# Altium schematic sheet Wand Controllers.schdoc
size 323 x 219 mm
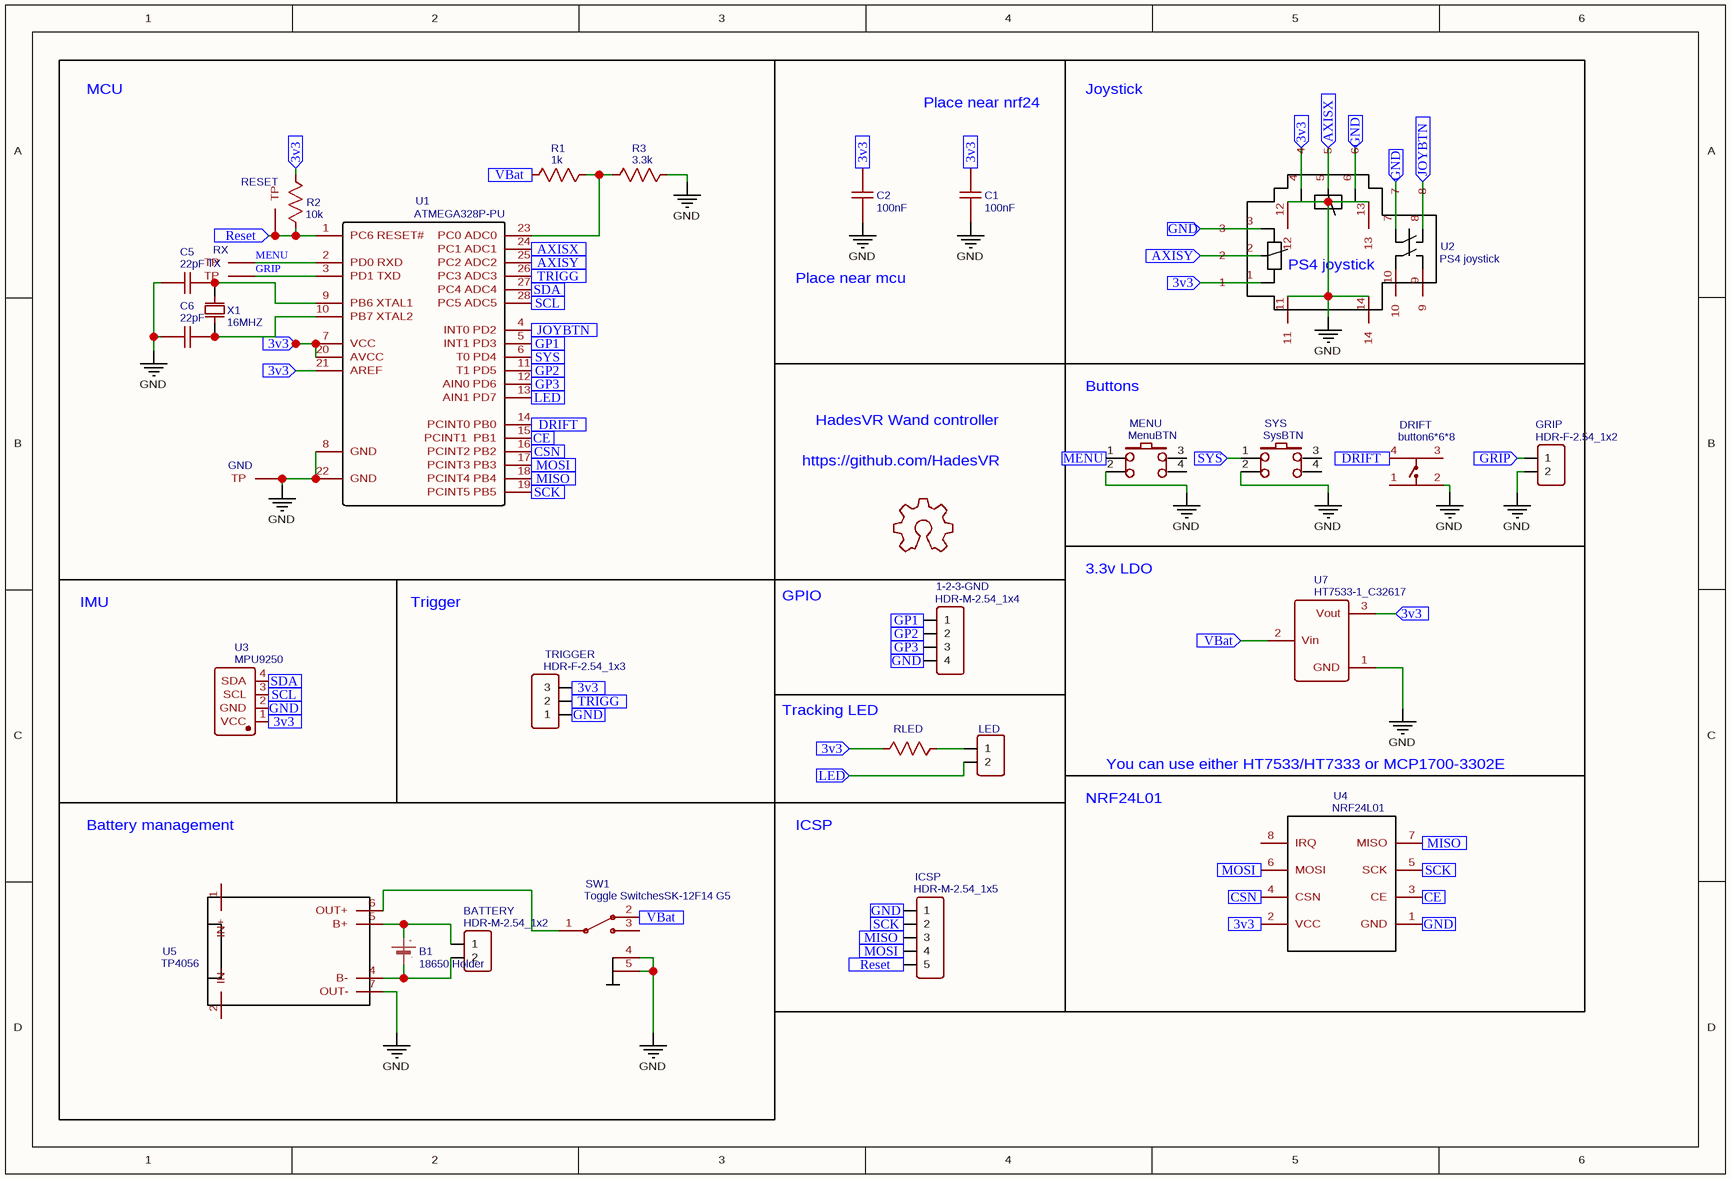
[diagram p0: Wand Controllers.schdoc]

## Parts
1-2-3-GND  HDR-M-2.54_1x4  [HDR-M-2.54_1X4]
#LOGO1  Graphic_Logo_Open_Hardware_Small  [OPEN_HARDWARE]  (value not drawn)
B1  18650 Holder  [BH-18650-A]
BATTERY  HDR-M-2.54_1x2  [HDR-M-2.54_1X2]
C1  100nF  [RAD-0.1]
C2  100nF  [RAD-0.1]
C5  22pF  [RAD-0.1]
C6  22pF  [RAD-0.1]
DRIFT  button6*6*8  [KEY-TH_4P-L6.0-W6.0-P4.50-LS7.5]
GND  RX  [TEST PAD FOOTPRINT]  (value not drawn)
GRIP  HDR-F-2.54_1x2  [HDR-F-2.54_1X2]
ICSP  HDR-M-2.54_1x5  [HDR-M-2.54_1X5]
LED  HDR-F-2.54_1x2  [HDR-F-2.54_1X2]  (value not drawn)
MENU  MenuBTN  [SQUISHY_TACT_8*8*5]
R1  1k  [R_AXIAL-0.3]
R2  10k  [R_AXIAL-0.3]
R3  3.3k  [R_AXIAL-0.3]
RESET  RX  [TEST PAD FOOTPRINT]  (value not drawn)
RLED  1k  [R_AXIAL-0.3]  (value not drawn)
RX  RX  [TEST PAD FOOTPRINT]  (value not drawn)
SW1  Toggle SwitchesSK-12F14 G5  [SW-TH_SK-12F14-G]
SYS  SysBTN  [SQUISHY_TACT_8*8*5]
TRIGGER  HDR-F-2.54_1x3  [HDR-F-2.54_1X3]
TX  TX  [TEST PAD FOOTPRINT]  (value not drawn)
U1  ATMEGA328P-PU  [DIP-28_L34.6-W7.3-P2.54-LS10.2-BL]
U2  PS4 joystick  [PS4 JOYSTICK]
U3  MPU9250  [MPU9250]
U4  NRF24L01  [MOD-NRF24L01]
U5  TP4056  [TP4056-PROTECT]
U7  HT7533-1_C32617  [TO-92-3_L4.9-W3.7-P1.27-L]
X1  16MHZ  [HC-49US_L11.0-W4.6-P4.88]

## Blocks framed on the sheet
MCU: C5 C6 GND R1-R3 RESET RX TX U1 X1
Joystick: U2
Buttons: DRIFT GRIP MENU SYS
IMU: U3
Trigger: TRIGGER
Battery management: B1 BATTERY SW1 U5
ICSP: ICSP

## Ports
3v3 (in), AXISX (in), AXISY (in), CE (in), CSN (in), DRIFT (in), GND (in), GP1 (in), GP2 (in), GP3 (in), GRIP (in), JOYBTN (in), LED (in), MENU (in), MISO (in), MOSI (in), Reset (in), SCK (in), SCL (in), SDA (in), SYS (in), TRIGG (in), VBat (in)

## Nets
GND: C1.1 C2.1 C5.1 C6.1 DRIFT.2 GND.1(TP) GRIP.2 MENU.2 R3.2 SW1.4 SW1.5 SYS.2 U1.8(GND) U1.22(GND) U2.11 U2.12 U2.13 U2.14 U5.7(OUT-) U7.1(GND)
3v3: C1.2 C2.2 R2.2 RLED.1 TRIGGER.3 U1.7(VCC) U1.20(AVCC) U1.21(AREF) U2.1 U2.4 U3.1(VCC) U4.2(VCC) U7.3(Vout) ; port 3v3
AXISX: U1.24(PC1_ADC1) U2.5 ; port AXISX
AXISY: U1.25(PC2_ADC2) U2.2 ; port AXISY
CE: U1.15(PCINT1__PB1) U4.3(CE) ; port CE
CSN: U1.16(PCINT2_PB2) U4.4(CSN) ; port CSN
DRIFT: DRIFT.4 U1.14(PCINT0_PB0) ; port DRIFT
GND: 1-2-3-GND.4 ICSP.1 TRIGGER.1 U2.3 U2.6 U2.7 U3.2(GND) U4.1(GND) ; port GND  [a separate net that carries the same name]
GP1: 1-2-3-GND.1 U1.5(INT1_PD3) ; port GP1
GP2: 1-2-3-GND.2 U1.11(T1_PD5) ; port GP2
GP3: 1-2-3-GND.3 U1.12(AIN0_PD6) ; port GP3
GRIP: TX.1(TP) U1.3(PD1_TXD)
GRIP: GRIP.1 ; port GRIP  [a separate net that carries the same name]
JOYBTN: U1.4(INT0_PD2) U2.8 ; port JOYBTN
LED: LED.2 U1.13(AIN1_PD7) ; port LED
MENU: RX.1(TP) U1.2(PD0_RXD)
MENU: MENU.1 ; port MENU  [a separate net that carries the same name]
MISO: ICSP.3 U1.18(PCINT4_PB4) U4.7(MISO) ; port MISO
MOSI: ICSP.4 U1.17(PCINT3_PB3) U4.6(MOSI) ; port MOSI
Reset: ICSP.5 R2.1 RESET.1(TP) U1.1(PC6_RESET#) ; port Reset
SCK: ICSP.2 U1.19(PCINT5_PB5) U4.5(SCK) ; port SCK
SCL: U1.28(PC5_ADC5) U3.3(SCL) ; port SCL
SDA: U1.27(PC4_ADC4) U3.4(SDA) ; port SDA
SYS: SYS.1 U1.6(T0_PD4) ; port SYS
TRIGG: TRIGGER.2 U1.26(PC3_ADC3) ; port TRIGG
VBat: R1.1 SW1.2 U7.2(Vin) ; port VBat
NetB1_1: B1.1(+) BATTERY.1 U5.5(B+)
NetB1_2: B1.2(-) BATTERY.2 U5.4(B-)
NetC5_2: C5.2 U1.9(PB6_XTAL1) X1.2(OSC2)
NetC6_2: C6.2 U1.10(PB7_XTAL2) X1.1(OSC1)
NetLED_1: LED.1 RLED.2
NetR1_2: R1.2 R3.1 U1.23(PC0_ADC0)
NetSW1_1: SW1.1 U5.6(OUT+)

Not connected (* = marked no-connect by the designer): DRIFT 1 3; MENU 3 4; SW1 3; SYS 3 4; U2 9 10; U4 8(IRQ); U5 1(IN+) 2(IN-)

## Notes on the sheet
- Place near nrf24
- Place near mcu
- HadesVR Wand controller
- https://github.com/HadesVR
- 3.3v LDO
- GPIO
- (near RLED) Tracking LED
- You can use either HT7533/HT7333 or MCP1700-3302E
- NRF24L01

## Library data of the parts
1-2-3-GND = HDR-M-2.54_1x4: Contributor: LCEDA_Lib; BOM_Supplier Part: C124378; BOM_Supplier: LCSC; spicePre: J; spiceSymbolName: HDR-M-2.54_1x4
#LOGO1 = Graphic_Logo_Open_Hardware_Small: Contributor: ezeda; spicePre: #; spiceSymbolName: Graphic_Logo_Open_Hardware_Small
B1 = 18650 Holder: Contributor: bcpersada; spicePre: B; spiceSymbolName: 16850 Holder
BATTERY = HDR-M-2.54_1x2: Contributor: LCEDA_Lib; BOM_Supplier Part: C124375; BOM_Supplier: LCSC; spicePre: J; spiceSymbolName: HDR-M-2.54_1x2
C1 C2 = 100nF: nameAlias: Value(F); Contributor: LCEDA_Lib; spicePre: C; spiceSymbolName: C_RAD-0.1_US
C5 C6 = 22pF: nameAlias: Value(F); Contributor: LCEDA_Lib; spicePre: C; spiceSymbolName: C_RAD-0.1_US
DRIFT = button6*6*8: BOM_Manufacturer: ReliaPro; BOM_Supplier Part: C59982; BOM_Supplier: LCSC; BOM_Manufacturer Part: button6*6*8; image: http://image.lceda.cn/szlcsc/C59982.jpg; spicePre: K; spiceSymbolName: button6*6*8
GND RESET RX = RX: Contributor: u271D; libConvert: Yes; Add into BOM: Yes; spicePre: T; spiceSymbolName: Test Pad
GRIP LED = HDR-F-2.54_1x2: Contributor: LCEDA_Lib; BOM_Supplier Part: C49661; BOM_Supplier: LCSC; spicePre: H; spiceSymbolName: HDR-F-2.54_1x2
ICSP = HDR-M-2.54_1x5: Contributor: LCEDA_Lib; BOM_Supplier Part: C358687; BOM_Supplier: LCSC; spicePre: J; spiceSymbolName: HDR-M-2.54_1x5
MENU = MenuBTN: BOM_Manufacturer: ReliaPro; BOM_Manufacturer Part: SMD Tactile Switch6.2*6.2*3.5; Contributor: ahrlad; BOM_Supplier Part: C57036; image: http://image.lceda.cn/szlcsc/C57036.jpg; spicePre: K; spiceSymbolName: Tactile Switch squishy 8*8*5mm
R1 RLED = 1k: nameAlias: Value(Ω); Contributor: LCEDA_Lib; spicePre: R; spiceSymbolName: R_AXIAL-0.3_US
R2 = 10k: nameAlias: Value(Ω); Contributor: LCEDA_Lib; spicePre: R; spiceSymbolName: R_AXIAL-0.3_US
R3 = 3.3k: nameAlias: Value(Ω); Contributor: LCEDA_Lib; spicePre: R; spiceSymbolName: R_AXIAL-0.3_US
SW1 = Toggle SwitchesSK-12F14 G5: BOM_Manufacturer: ReliaPro; BOM_Supplier Part: C59902; BOM_Supplier: LCSC; BOM_Manufacturer Part: Toggle SwitchesSK-12F14 G5; image: http://image.lceda.cn/szlcsc/C59902.jpg; spicePre: S; spiceSymbolName: Toggle SwitchesSK-12F14 G5
SYS = SysBTN: BOM_Manufacturer: ReliaPro; BOM_Manufacturer Part: SMD Tactile Switch6.2*6.2*3.5; Contributor: ahrlad; BOM_Supplier Part: C57036; image: http://image.lceda.cn/szlcsc/C57036.jpg; spicePre: K; spiceSymbolName: Tactile Switch squishy 8*8*5mm
TRIGGER = HDR-F-2.54_1x3: Contributor: LCEDA_Lib; BOM_Supplier Part: C146690; BOM_Supplier: LCSC; spicePre: H; spiceSymbolName: HDR-F-2.54_1x3
TX = TX: Contributor: u271D; libConvert: Yes; Add into BOM: Yes; spicePre: T; spiceSymbolName: Test Pad
U1 = ATMEGA328P-PU: BOM_Manufacturer: MICROCHIP; sourceId: Oic6oiASL; Contributor: LCSC; timeStamp: 1451725987; BOM_Supplier: LCSC; BOM_Manufacturer Part: ATMEGA328P-PU; image: //image.lceda.cn/szlcsc/C33901.jpg; BOM_Supplier Part: C33901; spicePre: U; spiceSymbolName: ATMEGA328P-PU
U2 = PS4 joystick: Contributor: HugoW; spicePre: U; spiceSymbolName: PS4 joystick
U3 = MPU9250: Contributor: Виктор Семинченко; spicePre: U; spiceSymbolName: MPU9250
U4 = NRF24L01: Contributor: NukeLeo; BOM_Manufacturer Part: NRF24L01; spicePre: U; spiceSymbolName: NRF24L01
U5 = TP4056: Contributor: quocanhhai; BOM_Manufacturer Part: TP4056-protect; link: https://dlnmh9ip6v2uc.cloudfront.net/datasheets/Prototyping/TP4056.pdf; spicePre: U; spiceSymbolName: TP4056
U7 = HT7533-1_C32617: BOM_Manufacturer: HOLTEK; SMT Type: Extend; BOM_Paste Type: expand; BOM_Supplier: LCSC; BOM_Manufacturer Part: HT7533-1; image: //image.lceda.cn/szlcsc/C32617.jpg; BOM_Supplier Part: C32617; BOM_LCSC Assembly: Yes; spicePre: U; spiceSymbolName: HT7533-1_C32617
X1 = 16MHZ: BOM_Manufacturer: JGHC; BOM_Manufacturer Part: 49SAC16000202060; nameAlias: Value; Contributor: LCSC; BOM_Paste Type: expand; BOM_Supplier: LCSC; BOM_Supplier Part: C390745; spicePre: X; spiceSymbolName: 49SAC16000202060